# Altium schematic sheet 01_TOP_LEVEL.SchDoc
size A3; SheetNumber: 1; SheetTotal: 6
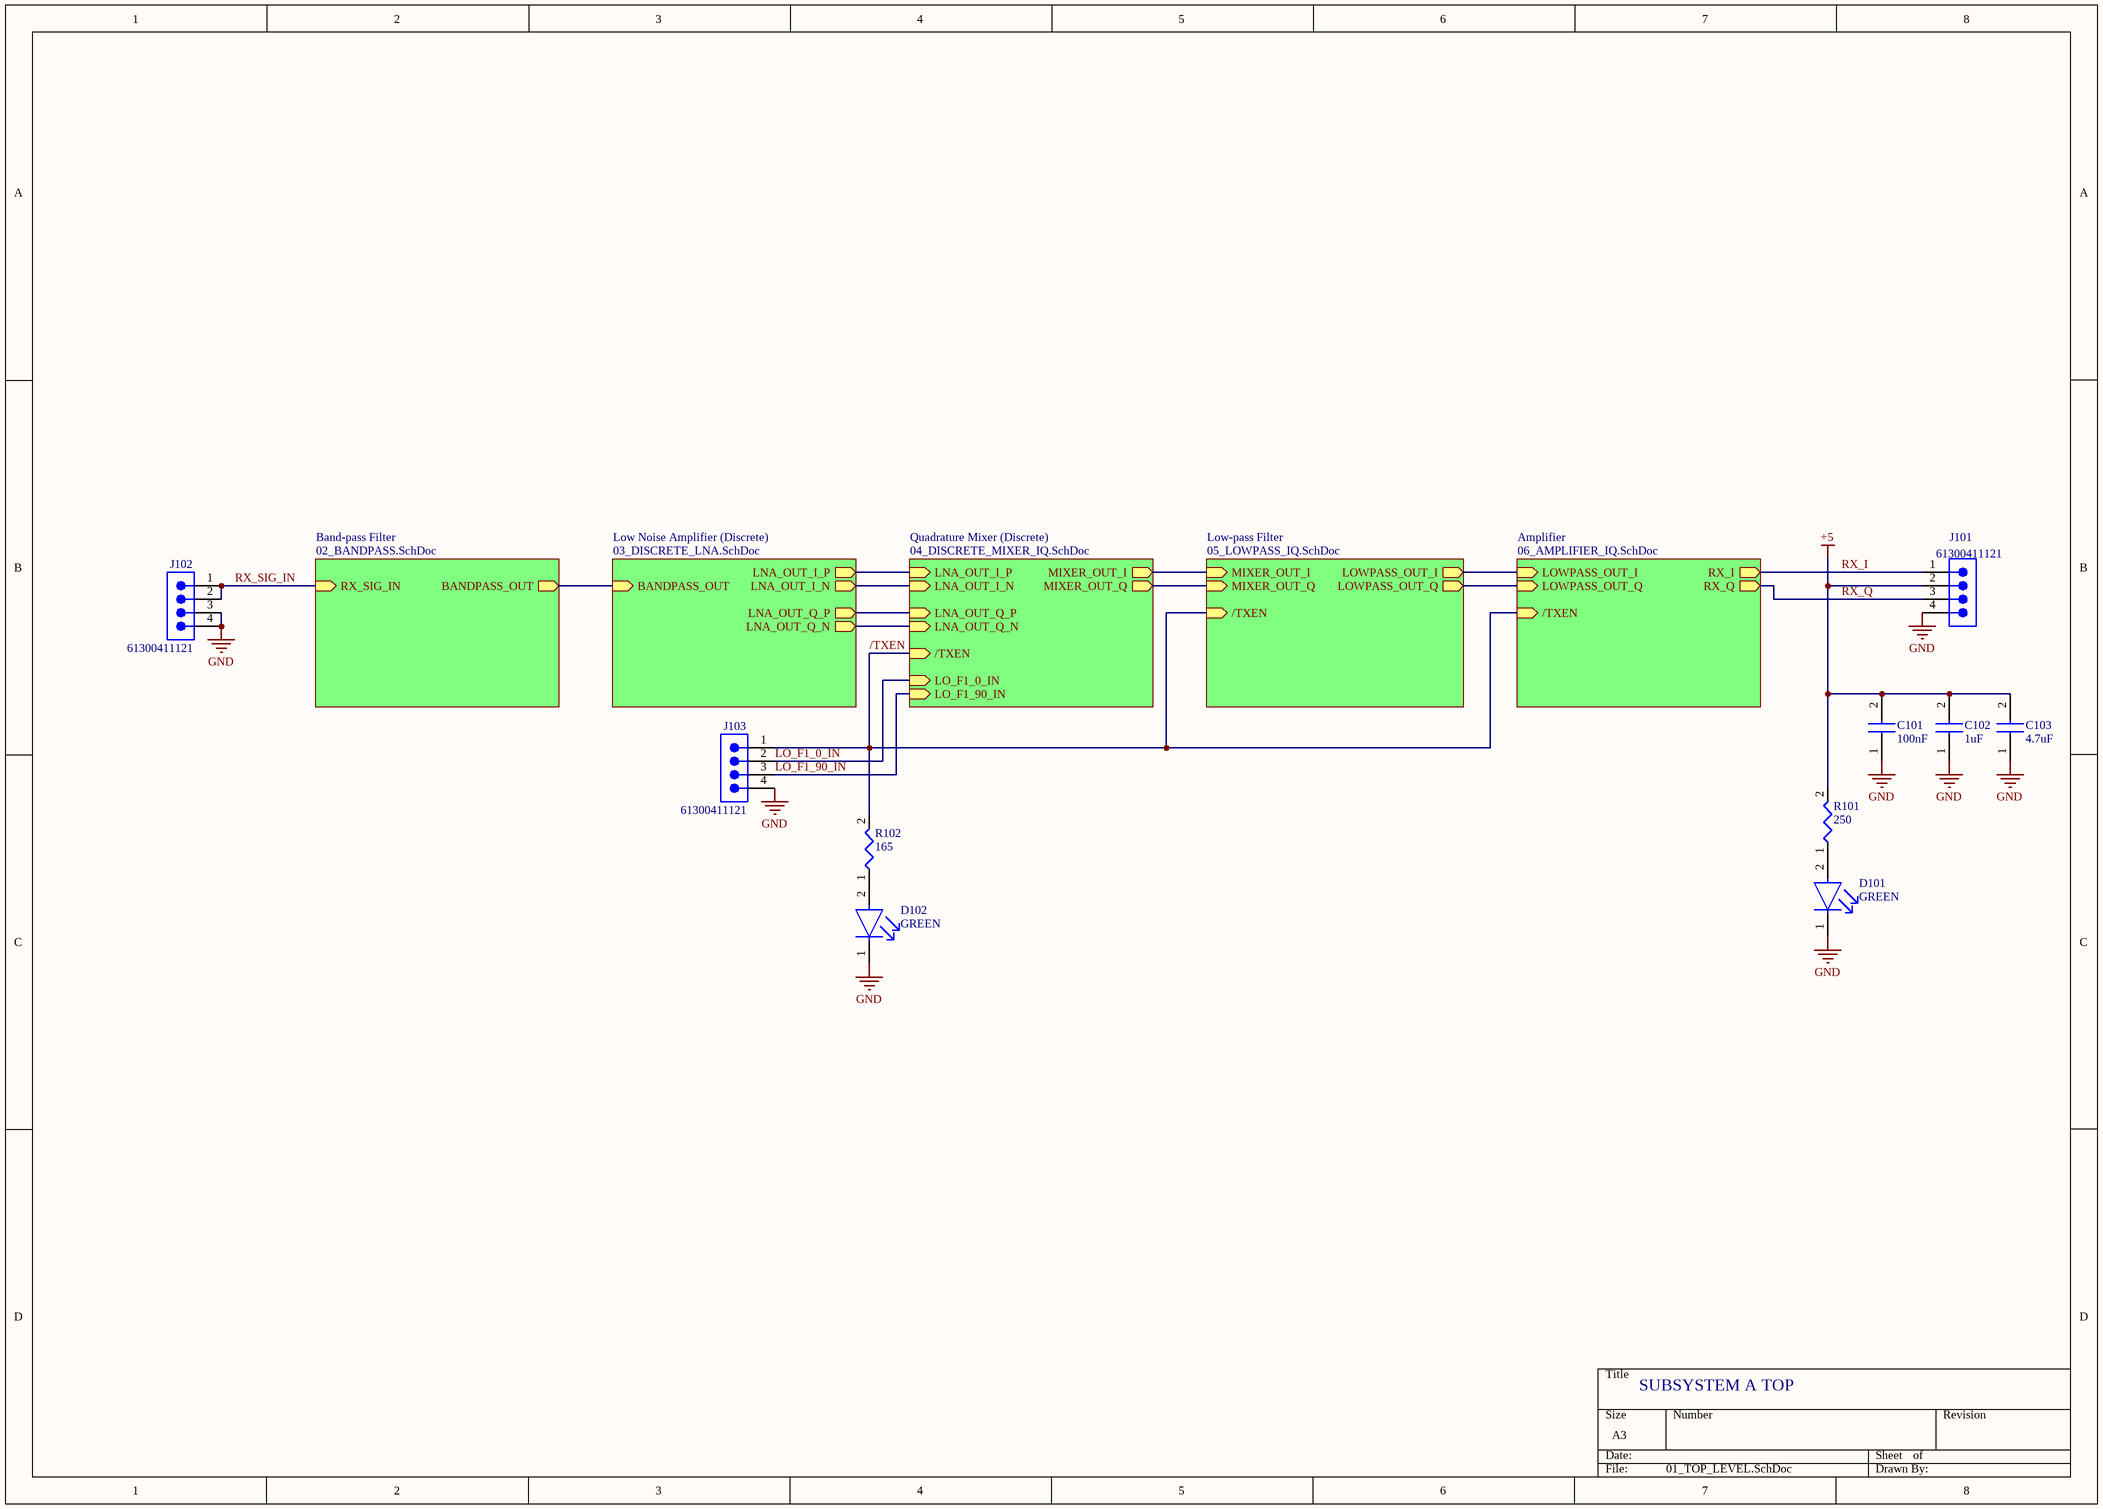
[diagram p0: 01_TOP_LEVEL.SchDoc]

## Parts
C101  100nF  [CAP_0805]
C102  1uF  [CAP_0805]
C103  4.7uF  [CAP_0805]
D101  GREEN  [FP-LTST-C170GKT-MFG]
D102  GREEN  [FP-LTST-C170GKT-MFG]
J101  61300411121  [61300411121]
J102  61300411121  [61300411121]
J103  61300411121  [61300411121]
R101  250  [RES_0805]
R102  165  [RES_0805]

## Sub-sheets
Amplifier = 06_AMPLIFIER_IQ.SchDoc: LOWPASS_OUT_I (in), LOWPASS_OUT_Q (in), RX_I (out), RX_Q (out), /TXEN (in)
Band-pass Filter = 02_BANDPASS.SchDoc: BANDPASS_OUT (out), RX_SIG_IN (in)
Low Noise Amplifier (Discrete) = 03_DISCRETE_LNA.SchDoc: BANDPASS_OUT (in), LNA_OUT_I_P (out), LNA_OUT_I_N (out), LNA_OUT_Q_P (out), LNA_OUT_Q_N (out)
Low-pass Filter = 05_LOWPASS_IQ.SchDoc: MIXER_OUT_I (in), MIXER_OUT_Q (in), /TXEN (in), LOWPASS_OUT_I (out), LOWPASS_OUT_Q (out)
Quadrature Mixer (Discrete) = 04_DISCRETE_MIXER_IQ.SchDoc: LNA_OUT_I_P (in), LNA_OUT_I_N (in), LNA_OUT_Q_P (in), LNA_OUT_Q_N (in), MIXER_OUT_I (out), MIXER_OUT_Q (out), LO_F1_0_IN (in), LO_F1_90_IN (in), /TXEN (in)

## Nets
+5: C101.2 C102.2 C103.2 J101.2 R101.2
GND: C101.1 C102.1 C103.1 D101.1(C) D102.1(C) J101.4 J102.3 J102.4 J103.4
/TXEN: J103.1 R102.2 ; sheet Quadrature Mixer (Discrete)//TXEN, sheet Low-pass Filter//TXEN, sheet Amplifier//TXEN
LO_F1_0_IN: J103.2 ; sheet Quadrature Mixer (Discrete)/LO_F1_0_IN
LO_F1_90_IN: J103.3 ; sheet Quadrature Mixer (Discrete)/LO_F1_90_IN
RX_I: J101.1 ; sheet Amplifier/RX_I
RX_Q: J101.3 ; sheet Amplifier/RX_Q
RX_SIG_IN: J102.1 J102.2 ; sheet Band-pass Filter/RX_SIG_IN
NetD101_2: D101.2(A) R101.1
NetD102_2: D102.2(A) R102.1
(unnamed): sheet Band-pass Filter/BANDPASS_OUT, sheet Low Noise Amplifier (Discrete)/BANDPASS_OUT
(unnamed): sheet Low Noise Amplifier (Discrete)/LNA_OUT_I_P, sheet Quadrature Mixer (Discrete)/LNA_OUT_I_P
(unnamed): sheet Low Noise Amplifier (Discrete)/LNA_OUT_I_N, sheet Quadrature Mixer (Discrete)/LNA_OUT_I_N
(unnamed): sheet Low Noise Amplifier (Discrete)/LNA_OUT_Q_P, sheet Quadrature Mixer (Discrete)/LNA_OUT_Q_P
(unnamed): sheet Low Noise Amplifier (Discrete)/LNA_OUT_Q_N, sheet Quadrature Mixer (Discrete)/LNA_OUT_Q_N
(unnamed): sheet Quadrature Mixer (Discrete)/MIXER_OUT_I, sheet Low-pass Filter/MIXER_OUT_I
(unnamed): sheet Quadrature Mixer (Discrete)/MIXER_OUT_Q, sheet Low-pass Filter/MIXER_OUT_Q
(unnamed): sheet Low-pass Filter/LOWPASS_OUT_I, sheet Amplifier/LOWPASS_OUT_I
(unnamed): sheet Low-pass Filter/LOWPASS_OUT_Q, sheet Amplifier/LOWPASS_OUT_Q

## Notes on the sheet
- SUBSYSTEM A TOP

## Library data of the parts
C101-C103 = CAP_0805: Capacitor SMD 0805; Height: 0.94mm
D101 D102 = CMP-1674-00002-6: LED GREEN CLEAR SMD; Dominant Wavelength: 569nm; Lens Style: Diffused; Forward Voltage: 2.1V; Number of Elements: 1; Wavelength: 565nm; Luminous Intensity: 6mcd; Test Current: 10mA; Power Dissipation: 100mW; Reverse Voltage: 5V; Forward Current: 30mA; Viewing Angle: 130°; Lens Color: Colorless; Min Operating Temperature: -55°C; Number of Pins: 2; Max Operating Temperature: 85°C; Color: Green; Radiation Hardening: No; Illumination Color: Green; Case Code (Metric): 2012; Lens Transparency: Clear; Case/Package: 0805; Width: 1.25mm; Case Code (Imperial): 0805; Package Quantity: 1; Height: 1.1mm; Depth: 1.25mm; Length: 2mm; Power Rating: 100mW; Lead Free: Lead Free; Number of LEDs: 1; Packaging: Tape and Reel; Mount: Surface Mount; Voltage: 5V; ComponentLink1Description: DigiKey; ComponentLink1URL: https://www.digikey.ca/en/products/detail/liteon/LTST-C170GKT/269226
J101-J103 = CMP-1502-01064-4: THT Vertical Pin Header WR-PHD, Pitch 2.54 mm, Single Row, 4 pins; Connector Type: Male Pin; Gender: Male; Current Rating: 3A; Number of Positions: 4; Operating Supply Voltage: 250V; Contact Resistance: 20mΩ; Pitch: 2.54mm; Max Operating Temperature: 105°C; Mount: Through Hole; Contact Material: Gold; Contact Plating: Gold; Number of Contacts: 4; Orientation: Vertical; Packaging: Bulk; Contact Mating Length: 5.9944mm; Voltage Rating: 250V; Number of Rows: 1; Height: 8.89mm; Lead Free: Lead Free; Lead Pitch: 2.54mm; Number of Pins: 4; Color: Black; Min Operating Temperature: -40°C; RoHS: Compliant; Termination: Solder; ComponentLink1Description: DigiKey; ComponentLink1URL: https://www.digikey.com/en/products/detail/w%C3%BCrth-elektronik/61300411121/4846827?s=N4IgTCBcDaIGwEYDMAGFAWBWwJAXQF8g
R101 R102 = RES_0805: Resistor SMD 0805